# Altium schematic sheet bluetooth.SchDoc
size A4; SheetNumber: 4; SheetTotal: 4
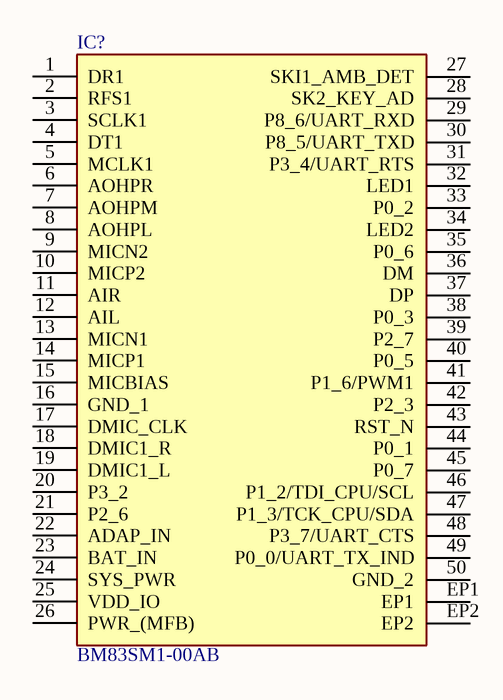
[diagram p0: bluetooth.SchDoc]

## Parts
IC?  BM83SM1-00AB  [BM83SM100AA]

## Nets

Not connected (* = marked no-connect by the designer): IC? 1(DR1) 2(RFS1) 3(SCLK1) 4(DT1) 5(MCLK1) 6(AOHPR) 7(AOHPM) 8(AOHPL) 9(MICN2) 10(MICP2) 11(AIR) 12(AIL) 13(MICN1) 14(MICP1) 15(MICBIAS) 16(GND_1) 17(DMIC_CLK) 18(DMIC1_R) 19(DMIC1_L) 20(P3_2) 21(P2_6) 22(ADAP_IN) 23(BAT_IN) 24(SYS_PWR) 25(VDD_IO) 26(PWR_(MFB)) 27(SKI1_AMB_DET) 28(SK2_KEY_AD) 29(P8_6/UART_RXD) 30(P8_5/UART_TXD) 31(P3_4/UART_RTS) 32(LED1) 33(P0_2) 34(LED2) 35(P0_6) 36(DM) 37(DP) 38(P0_3) 39(P2_7) 40(P0_5) 41(P1_6/PWM1) 42(P2_3) 43(RST_N) 44(P0_1) 45(P0_7) 46(P1_2/TDI_CPU/SCL) 47(P1_3/TCK_CPU/SDA) 48(P3_7/UART_CTS) 49(P0_0/UART_TX_IND) 50(GND_2) EP1 EP2

## Library data of the parts
IC? = BM83SM1-00AB: Integrated Circuit; Manufacturer_Name: Microchip; Datasheet Link: http://ww1.microchip.com/downloads/en/DeviceDoc/BM83_Bluetooth_Stereo_Audio_Module_Data_Sheet_DS70005402A.pdf; Height: 2.5mm; Manufacturer_Part_Number: BM83SM1-00AB; Mouser Part Number: 579-BM83SM1-00AB; Mouser Price/Stock: https://www.mouser.co.uk/ProductDetail/Microchip-Technology/BM83SM1-00AB?qs=W%2FMpXkg%252BdQ4%2FPurIjXhtZA%3D%3D; Arrow Part Number: BM83SM1-00AB; Arrow Price/Stock: https://www.arrow.com/en/products/bm83sm1-00ab/microchip-technology.html?utm_currency=USD&region=nac